# Altium schematic sheet Sheet1.SchDoc
size A1
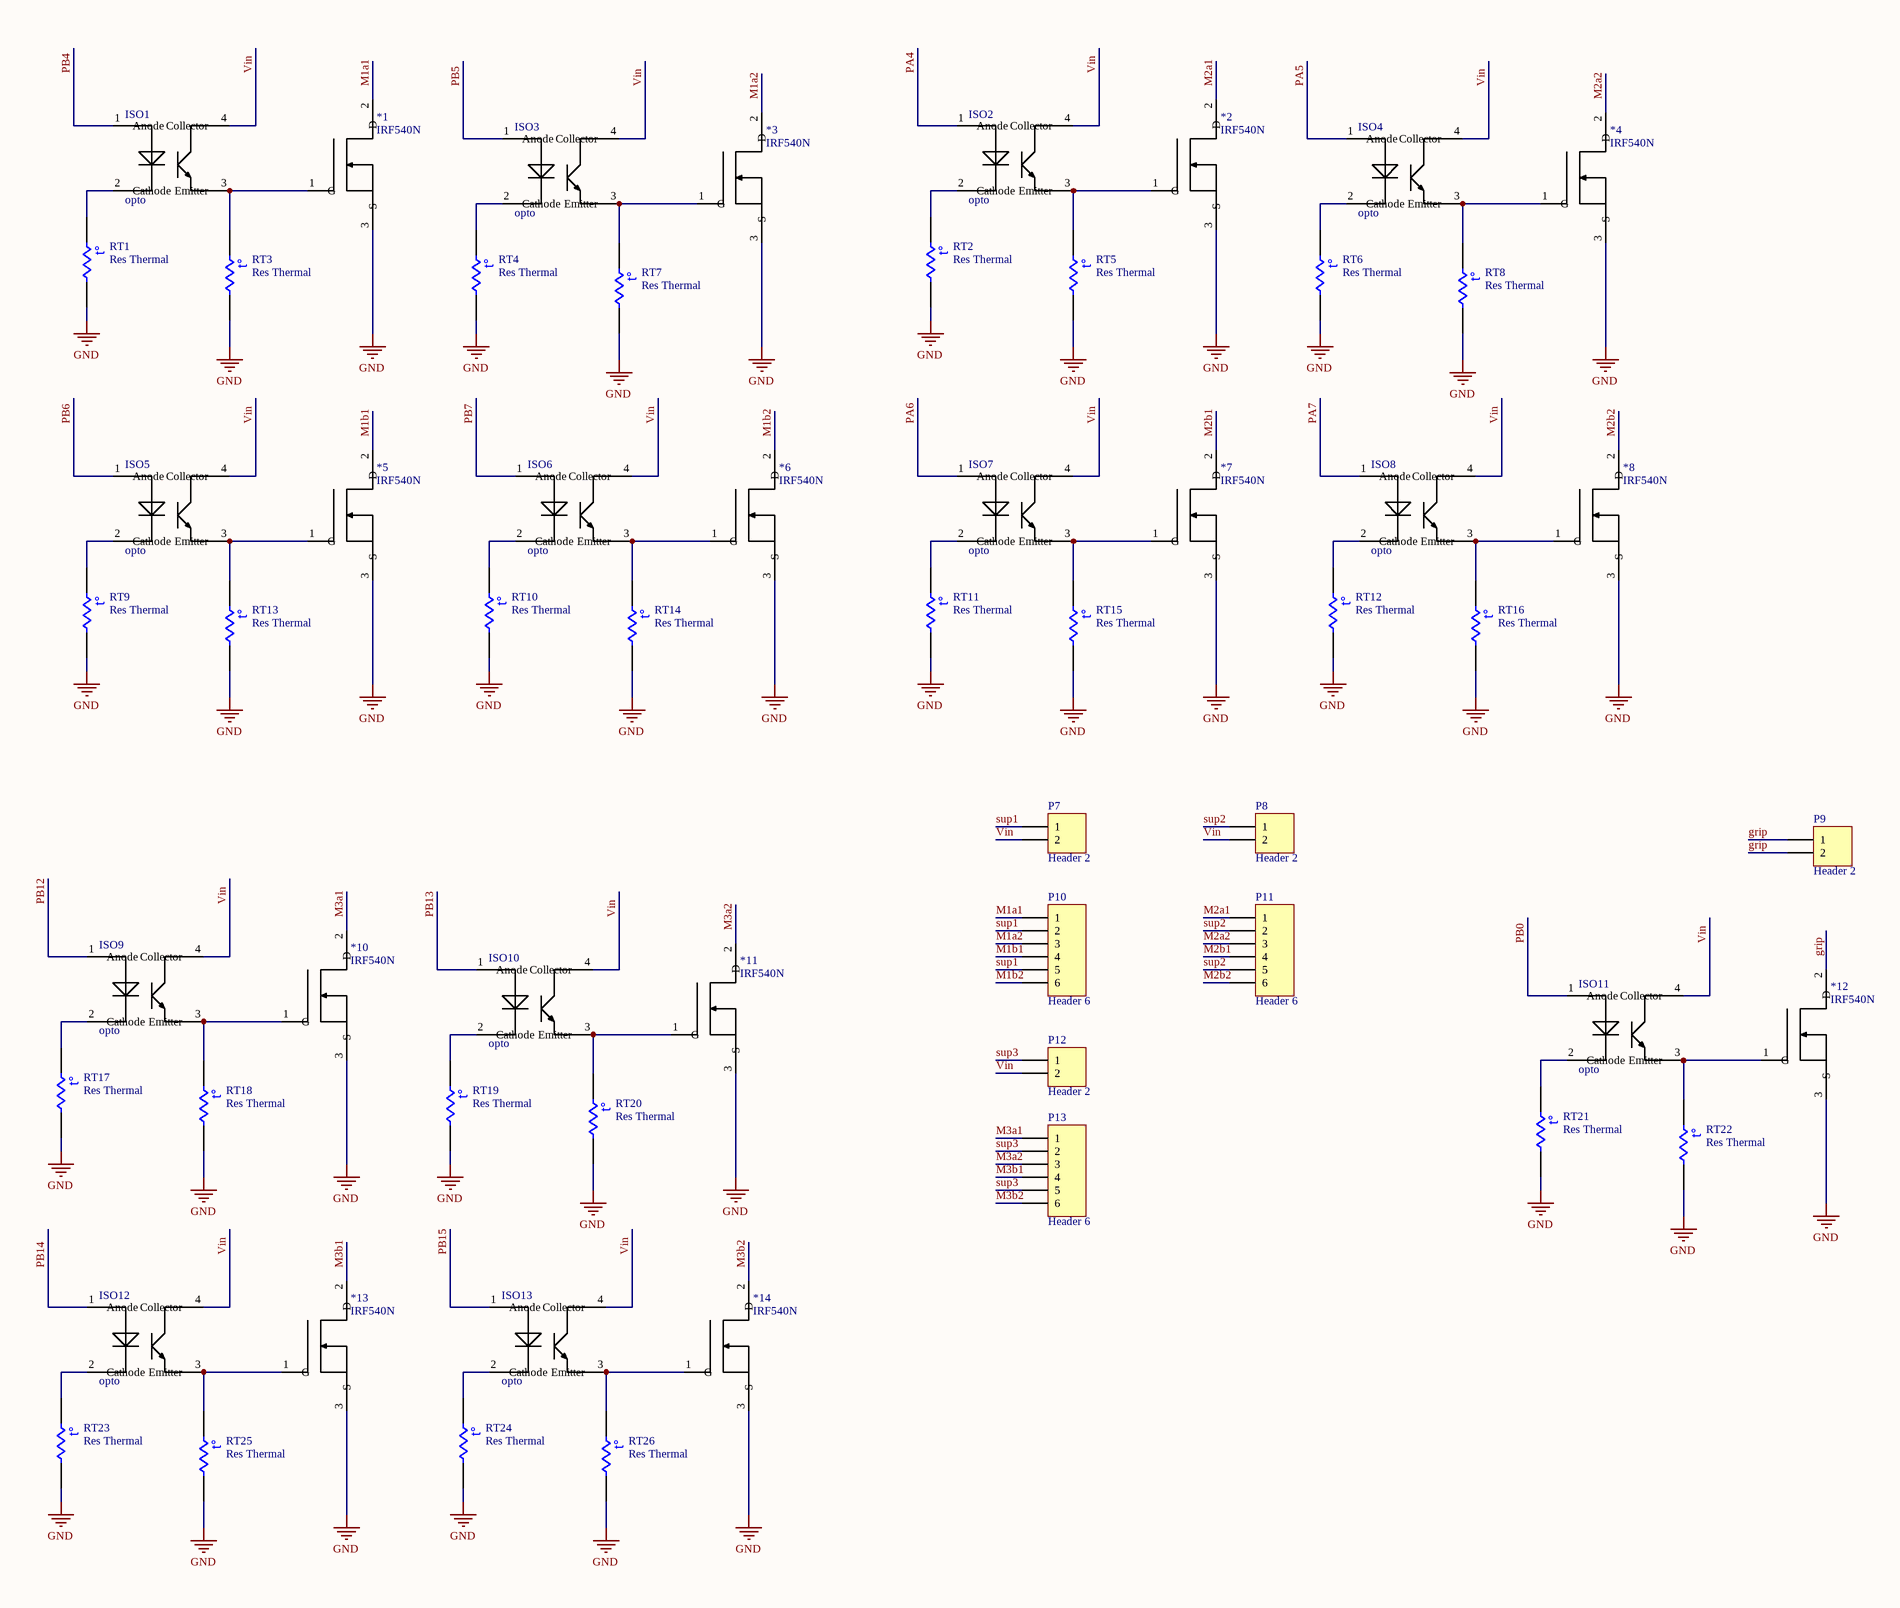
[diagram p0: Sheet1.SchDoc, left]
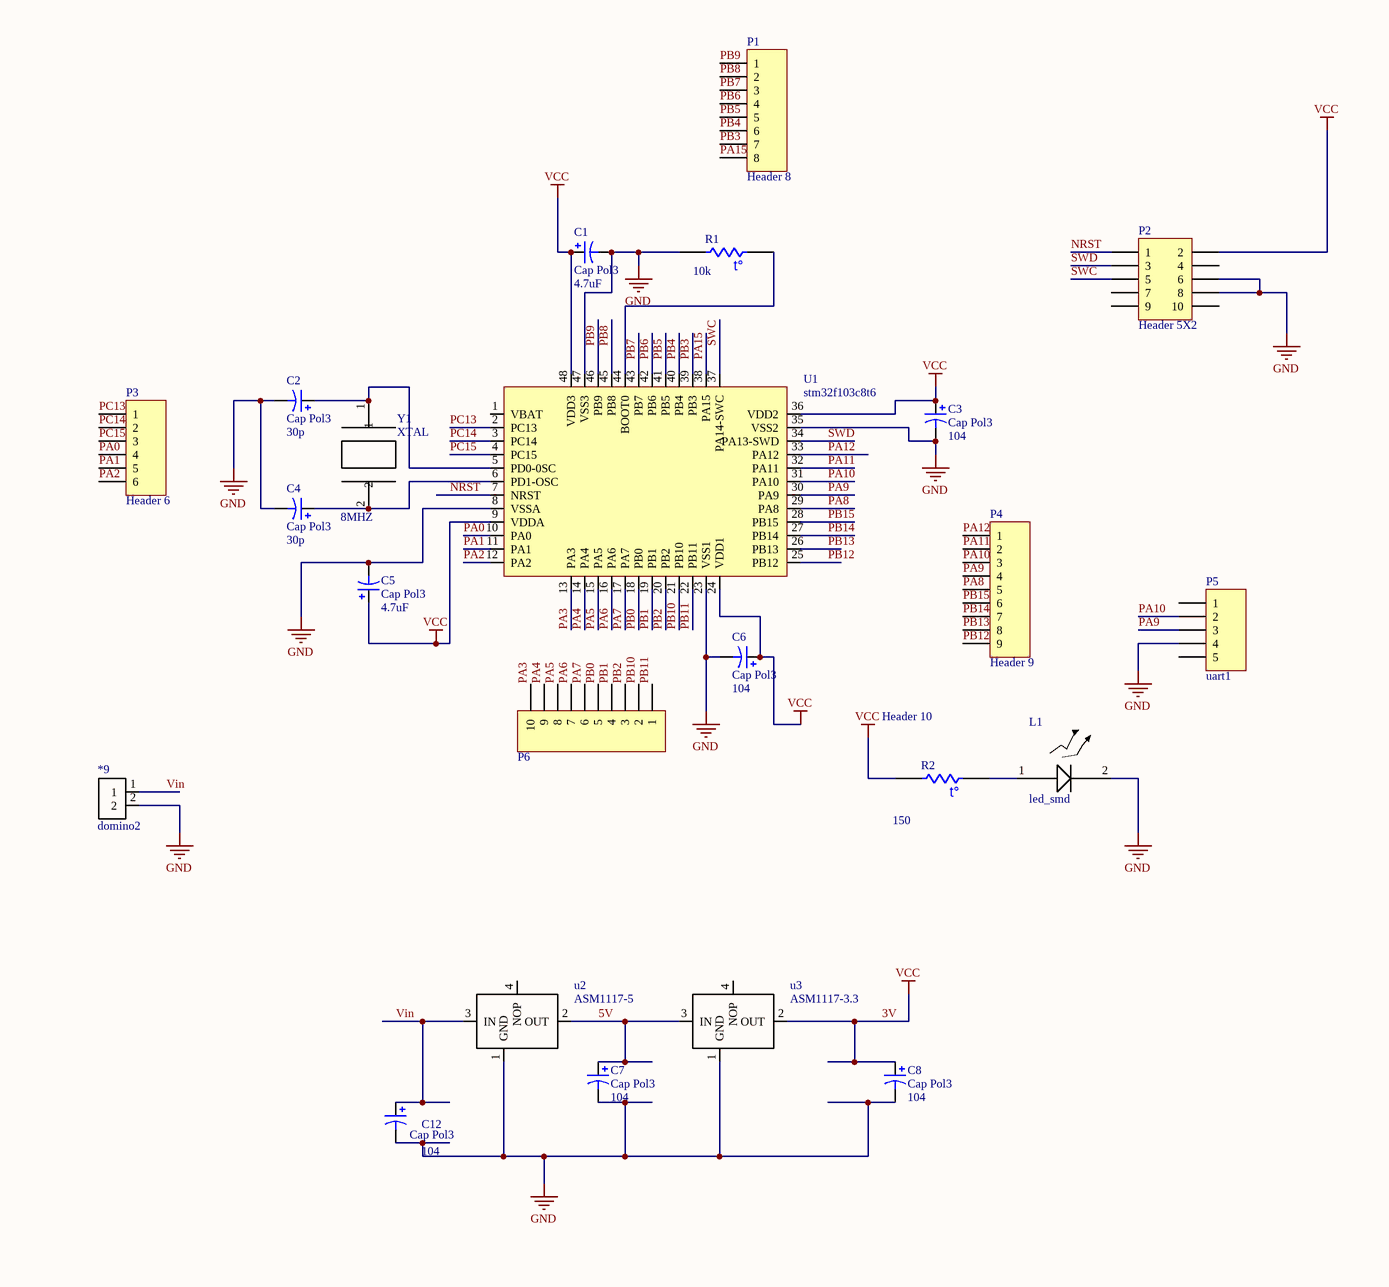
[diagram p1: Sheet1.SchDoc, right]

## Parts
*1  IRF540N  [TO220]
*2  IRF540N  [TO220]
*3  IRF540N  [TO220]
*4  IRF540N  [TO220]
*5  IRF540N  [TO220]
*6  IRF540N  [TO220]
*7  IRF540N  [TO220]
*8  IRF540N  [TO220]
*9  domino2  [Domino_2]
*10  IRF540N  [TO220]
*11  IRF540N  [TO220]
*12  IRF540N  [TO220]
*13  IRF540N  [TO220]
*14  IRF540N  [TO220]
C1  Cap Pol3  value 4.7uF  [C0805]
C2  Cap Pol3  value 30p  [C0805]
C3  Cap Pol3  value 104  [C0805]
C4  Cap Pol3  value 30p  [C0805]
C5  Cap Pol3  value 4.7uF  [C0805]
C6  Cap Pol3  value 104  [C0805]
C7  Cap Pol3  value 104  [C0805]
C8  Cap Pol3  value 104  [C0805]
C12  Cap Pol3  value 104  [C0805]
ISO1  opto  [opto_smd]
ISO2  opto  [opto_smd]
ISO3  opto  [opto_smd]
ISO4  opto  [opto_smd]
ISO5  opto  [opto_smd]
ISO6  opto  [opto_smd]
ISO7  opto  [opto_smd]
ISO8  opto  [opto_smd]
ISO9  opto  [opto_smd]
ISO10  opto  [opto_smd]
ISO11  opto  [opto_smd]
ISO12  opto  [opto_smd]
ISO13  opto  [opto_smd]
L1  led_smd  [led_smd]
P1  Header 8  [HDR1X8]
P2  Header 5X2  [HDR2X5]
P3  Header 6  [HDR1X6]
P4  Header 9  [HDR1X9]
P5  uart1  [HDR1X5]
P6  Header 10  [HDR1X10]
P7  Header 2  [HDR1X2]
P8  Header 2  [HDR1X2]
P9  Header 2  [HDR1X2]
P10  Header 6  [HDR1X6]
P11  Header 6  [HDR1X6]
P12  Header 2  [HDR1X2]
P13  Header 6  [HDR1X6]
R1  value 10k  [6-0805_N]
R2  value 150  [6-0805_N]
RT1  Res Thermal  [6-0805_N]
RT2  Res Thermal  [6-0805_N]
RT3  Res Thermal  [6-0805_N]
RT4  Res Thermal  [6-0805_N]
RT5  Res Thermal  [6-0805_N]
RT6  Res Thermal  [6-0805_N]
RT7  Res Thermal  [6-0805_N]
RT8  Res Thermal  [6-0805_N]
RT9  Res Thermal  [6-0805_N]
RT10  Res Thermal  [6-0805_N]
RT11  Res Thermal  [6-0805_N]
RT12  Res Thermal  [6-0805_N]
RT13  Res Thermal  [6-0805_N]
RT14  Res Thermal  [6-0805_N]
RT15  Res Thermal  [6-0805_N]
RT16  Res Thermal  [6-0805_N]
RT17  Res Thermal  [6-0805_N]
RT18  Res Thermal  [6-0805_N]
RT19  Res Thermal  [6-0805_N]
RT20  Res Thermal  [6-0805_N]
RT21  Res Thermal  [6-0805_N]
RT22  Res Thermal  [6-0805_N]
RT23  Res Thermal  [6-0805_N]
RT24  Res Thermal  [6-0805_N]
RT25  Res Thermal  [6-0805_N]
RT26  Res Thermal  [6-0805_N]
U1  stm32f103c8t6  [LQFP48_stm32]
u2  ASM1117-5  [SOT223]
u3  ASM1117-3.3  [SOT223]
Y1  XTAL  value 8MHZ  [xtal_smd]

## Nets
3V: C1.1 C3.1 C5.1 C6.1 C8.1 P2.2 R2.2 U1.9(VDDA) U1.24(VDD1) U1.36(VDD2) U1.48(VDD3) u3.2(OUT)  [also labelled VCC]
GND: *1.3(S) *2.3(S) *3.3(S) *4.3(S) *5.3(S) *6.3(S) *7.3(S) *8.3(S) *9.2 *10.3(S) *11.3(S) *12.3(S) *13.3(S) *14.3(S) C1.2 C2.2 C3.2 C4.2 C5.2 C6.2 C7.2 C8.2 C12.2 L1.2 P2.6 P2.8 P5.4 R1.2 RT1.2 RT2.2 RT3.2 RT4.2 RT5.2 RT6.2 RT7.2 RT8.2 RT9.2 RT10.2 RT11.2 RT12.2 RT13.2 RT14.2 RT15.2 RT16.2 RT17.2 RT18.2 RT19.2 RT20.2 RT21.2 RT22.2 RT23.2 RT24.2 RT25.2 RT26.2 U1.8(VSSA) U1.23(VSS1) U1.35(VSS2) U1.47(VSS3) u2.1(GND) u3.1(GND)
5V: C7.1 u2.2(OUT) u3.3(IN)
grip: *12.2(D) P9.1 P9.2
M1a1: *1.2(D) P10.1
M1a2: *3.2(D) P10.3
M1b1: *5.2(D) P10.4
M1b2: *6.2(D) P10.6
M2a1: *2.2(D) P11.1
M2a2: *4.2(D) P11.3
M2b1: *7.2(D) P11.4
M2b2: *8.2(D) P11.6
M3a1: *10.2(D) P13.1
M3a2: *11.2(D) P13.3
M3b1: *13.2(D) P13.4
M3b2: *14.2(D) P13.6
NRST: P2.1 U1.7(NRST)
PA0: P3.4 U1.10(PA0)
PA1: P3.5 U1.11(PA1)
PA2: P3.6 U1.12(PA2)
PA3: P6.10 U1.13(PA3)
PA4: ISO2.1(Anode) P6.9 U1.14(PA4)
PA5: ISO4.1(Anode) P6.8 U1.15(PA5)
PA6: ISO7.1(Anode) P6.7 U1.16(PA6)
PA7: ISO8.1(Anode) P6.6 U1.17(PA7)
PA8: P4.5 U1.29(PA8)
PA9: P4.4 P5.3 U1.30(PA9)
PA10: P4.3 P5.2 U1.31(PA10)
PA11: P4.2 U1.32(PA11)
PA12: P4.1 U1.33(PA12)
PA15: P1.8 U1.38(PA15)
PB0: ISO11.1(Anode) P6.5 U1.18(PB0)
PB1: P6.4 U1.19(PB1)
PB2: P6.3 U1.20(PB2)
PB3: P1.7 U1.39(PB3)
PB4: ISO1.1(Anode) P1.6 U1.40(PB4)
PB5: ISO3.1(Anode) P1.5 U1.41(PB5)
PB6: ISO5.1(Anode) P1.4 U1.42(PB6)
PB7: ISO6.1(Anode) P1.3 U1.43(PB7)
PB8: P1.2 U1.45(PB8)
PB9: P1.1 U1.46(PB9)
PB10: P6.2 U1.21(PB10)
PB11: P6.1 U1.22(PB11)
PB12: ISO9.1(Anode) P4.9 U1.25(PB12)
PB13: ISO10.1(Anode) P4.8 U1.26(PB13)
PB14: ISO12.1(Anode) P4.7 U1.27(PB14)
PB15: ISO13.1(Anode) P4.6 U1.28(PB15)
PC13: P3.1 U1.2(PC13)
PC14: P3.2 U1.3(PC14)
PC15: P3.3 U1.4(PC15)
sup1: P7.1 P10.2 P10.5
sup2: P8.1 P11.2 P11.5
sup3: P12.1 P13.2 P13.5
SWC: P2.5 U1.37(PA14-SWC)
SWD: P2.3 U1.34(PA13-SWD)
Vin: *9.1 C12.1 ISO1.4(Collector) ISO2.4(Collector) ISO3.4(Collector) ISO4.4(Collector) ISO5.4(Collector) ISO6.4(Collector) ISO7.4(Collector) ISO8.4(Collector) ISO9.4(Collector) ISO10.4(Collector) ISO11.4(Collector) ISO12.4(Collector) ISO13.4(Collector) P7.2 P8.2 P12.2 u2.3(IN)
Net*1_1: *1.1(G) ISO1.3(Emitter) RT3.1
Net*2_1: *2.1(G) ISO2.3(Emitter) RT5.1
Net*3_1: *3.1(G) ISO3.3(Emitter) RT7.1
Net*4_1: *4.1(G) ISO4.3(Emitter) RT8.1
Net*5_1: *5.1(G) ISO5.3(Emitter) RT13.1
Net*6_1: *6.1(G) ISO6.3(Emitter) RT14.1
Net*7_1: *7.1(G) ISO7.3(Emitter) RT15.1
Net*8_1: *8.1(G) ISO8.3(Emitter) RT16.1
Net*10_1: *10.1(G) ISO9.3(Emitter) RT18.1
Net*11_1: *11.1(G) ISO10.3(Emitter) RT20.1
Net*12_1: *12.1(G) ISO11.3(Emitter) RT22.1
Net*13_1: *13.1(G) ISO12.3(Emitter) RT25.1
Net*14_1: *14.1(G) ISO13.3(Emitter) RT26.1
NetC2_1: C2.1 U1.5(PD0-0SC) Y1.1
NetC4_1: C4.1 U1.6(PD1-OSC) Y1.2
NetISO1_2: ISO1.2(Cathode) RT1.1
NetISO2_2: ISO2.2(Cathode) RT2.1
NetISO3_2: ISO3.2(Cathode) RT4.1
NetISO4_2: ISO4.2(Cathode) RT6.1
NetISO5_2: ISO5.2(Cathode) RT9.1
NetISO6_2: ISO6.2(Cathode) RT10.1
NetISO7_2: ISO7.2(Cathode) RT11.1
NetISO8_2: ISO8.2(Cathode) RT12.1
NetISO9_2: ISO9.2(Cathode) RT17.1
NetISO10_2: ISO10.2(Cathode) RT19.1
NetISO11_2: ISO11.2(Cathode) RT21.1
NetISO12_2: ISO12.2(Cathode) RT23.1
NetISO13_2: ISO13.2(Cathode) RT24.1
NetL1_1: L1.1 R2.1
NetR1_1: R1.1 U1.44(BOOT0)

Not connected (* = marked no-connect by the designer): P2 4 7 9 10; P5 1 5; U1 1(VBAT); u2 4(NOP); u3 4(NOP)

## Notes on the sheet
- (in symbol Res Thermal) t°

## Library data of the parts
C1-C8 C12 = Cap Pol3: Polarized Capacitor (Surface Mount); Published: 8-Jun-2000; LatestRevisionDate: 29-May-2009; LatestRevisionNote: IPC-7351 Footprint Added.; PackageReference: C0805; Publisher: Altium Limited; PackageDescription: Chip Capacitor
P1 = Header 8: Header, 8-Pin; LatestRevisionDate: 17-Jul-2002; LatestRevisionNote: Re-released for DXP Platform.; Publisher: Altium Limited
P2 = Header 5X2: Header, 5-Pin, Dual row; LatestRevisionDate: 17-Jul-2002; LatestRevisionNote: Re-released for DXP Platform.; Publisher: Altium Limited
P3 P10 P11 P13 = Header 6: Header, 6-Pin; LatestRevisionDate: 17-Jul-2002; LatestRevisionNote: Re-released for DXP Platform.; Publisher: Altium Limited
P4 = Header 9: Header, 9-Pin; LatestRevisionDate: 17-Jul-2002; LatestRevisionNote: Re-released for DXP Platform.; Publisher: Altium Limited
P5 = Header 5: Header, 5-Pin; LatestRevisionDate: 17-Jul-2002; LatestRevisionNote: Re-released for DXP Platform.; Publisher: Altium Limited
P6 = Header 10: Header, 10-Pin; LatestRevisionDate: 17-Jul-2002; LatestRevisionNote: Re-released for DXP Platform.; Publisher: Altium Limited
P7-P9 P12 = Header 2: Header, 2-Pin; LatestRevisionDate: 17-Jul-2002; LatestRevisionNote: Re-released for DXP Platform.; Publisher: Altium Limited
R1 R2 RT1-RT26 = Res Thermal: Thermistor; Published: 24-Mar-1999; LatestRevisionDate: 29-May-2009; LatestRevisionNote: IPC-7351 Footprint Added.; PackageVersion: Mar-2003; PackageReference: 6-0805; Publisher: Altium Limited; PackageDescription: Chip Resistor 0805 Case Size; Code_IPC: RESC2012
u3 = ASM1117-5